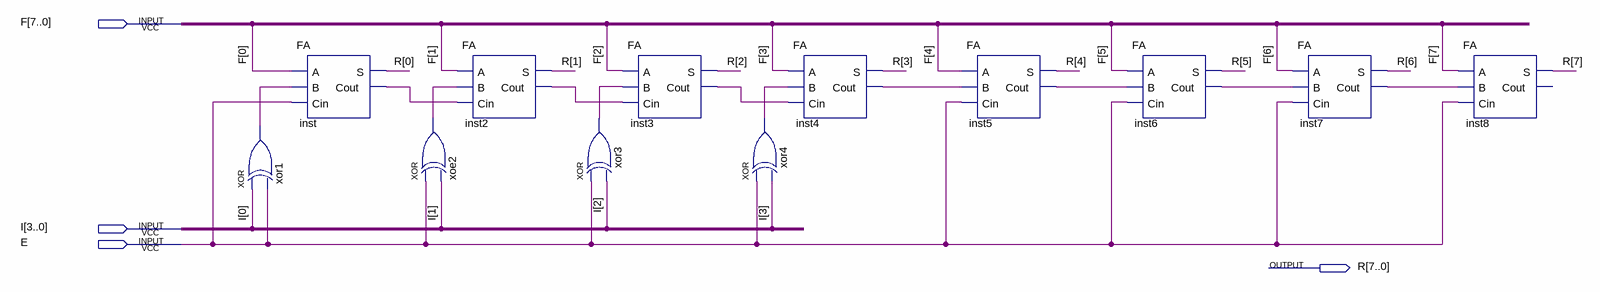
[diagram p0: schematic sheet]
// Quartus schematic Question2.bdf as structural Verilog: 12 symbols, 4 pins
module Question2 (
  input  [7:0] F,
  input  [3:0] I,
  input  E,
  output [7:0] R
);

  wire inst2_cout, inst3_cout, inst4_cout, inst5_cout, inst6_cout, inst7_cout, inst_cout, xoe2_out, xor1_out,
       xor3_out, xor4_out;

  xor xor1 (xor1_out, I[0], E);
  FA inst (.A(F[0]), .B(xor1_out), .Cin(E), .S(R[0]), .Cout(inst_cout));
  xor xoe2 (xoe2_out, E, I[1]);
  FA inst2 (.A(F[1]), .B(xoe2_out), .Cin(inst_cout), .S(R[1]), .Cout(inst2_cout));
  xor xor3 (xor3_out, E, I[2]);
  FA inst3 (.A(F[2]), .B(xor3_out), .Cin(inst2_cout), .S(R[2]), .Cout(inst3_cout));
  xor xor4 (xor4_out, E, I[3]);
  FA inst4 (.A(F[3]), .B(xor4_out), .Cin(inst3_cout), .S(R[3]), .Cout(inst4_cout));
  FA inst5 (.A(F[4]), .B(inst4_cout), .Cin(E), .S(R[4]), .Cout(inst5_cout));
  FA inst6 (.A(F[5]), .B(inst5_cout), .Cin(E), .S(R[5]), .Cout(inst6_cout));
  FA inst7 (.A(F[6]), .B(inst6_cout), .Cin(E), .S(R[6]), .Cout(inst7_cout));
  FA inst8 (.A(F[7]), .B(inst7_cout), .Cin(E), .S(R[7]));  // open: Cout
endmodule
